# Altium schematic sheet Backup_supplies.SchDoc
size A4
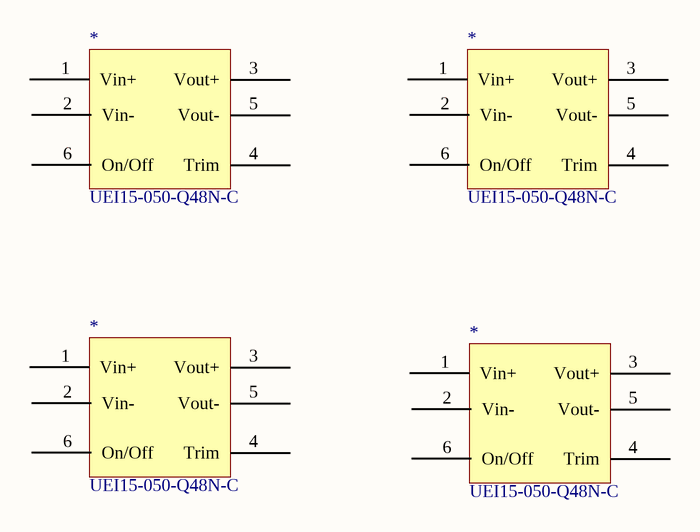
[diagram p0: Backup_supplies.SchDoc]

## Parts
(Parts that share a designator on the sheet are numbered #1, #2 ... from top to bottom, then left to right.)
*#1  UEI15-050-Q48N-C
*#2  UEI15-050-Q48N-C
*#3  UEI15-050-Q48N-C
*#4  UEI15-050-Q48N-C

## Nets

Not connected (* = marked no-connect by the designer): *#1 1(Vin+) 2(Vin-) 3(Vout+) 4(Trim) 5(Vout-) 6(On/Off); *#2 1(Vin+) 2(Vin-) 3(Vout+) 4(Trim) 5(Vout-) 6(On/Off); *#3 1(Vin+) 2(Vin-) 3(Vout+) 4(Trim) 5(Vout-) 6(On/Off); *#4 1(Vin+) 2(Vin-) 3(Vout+) 4(Trim) 5(Vout-) 6(On/Off)